# Altium project USB-C Power Delivery Board.PrjPcb
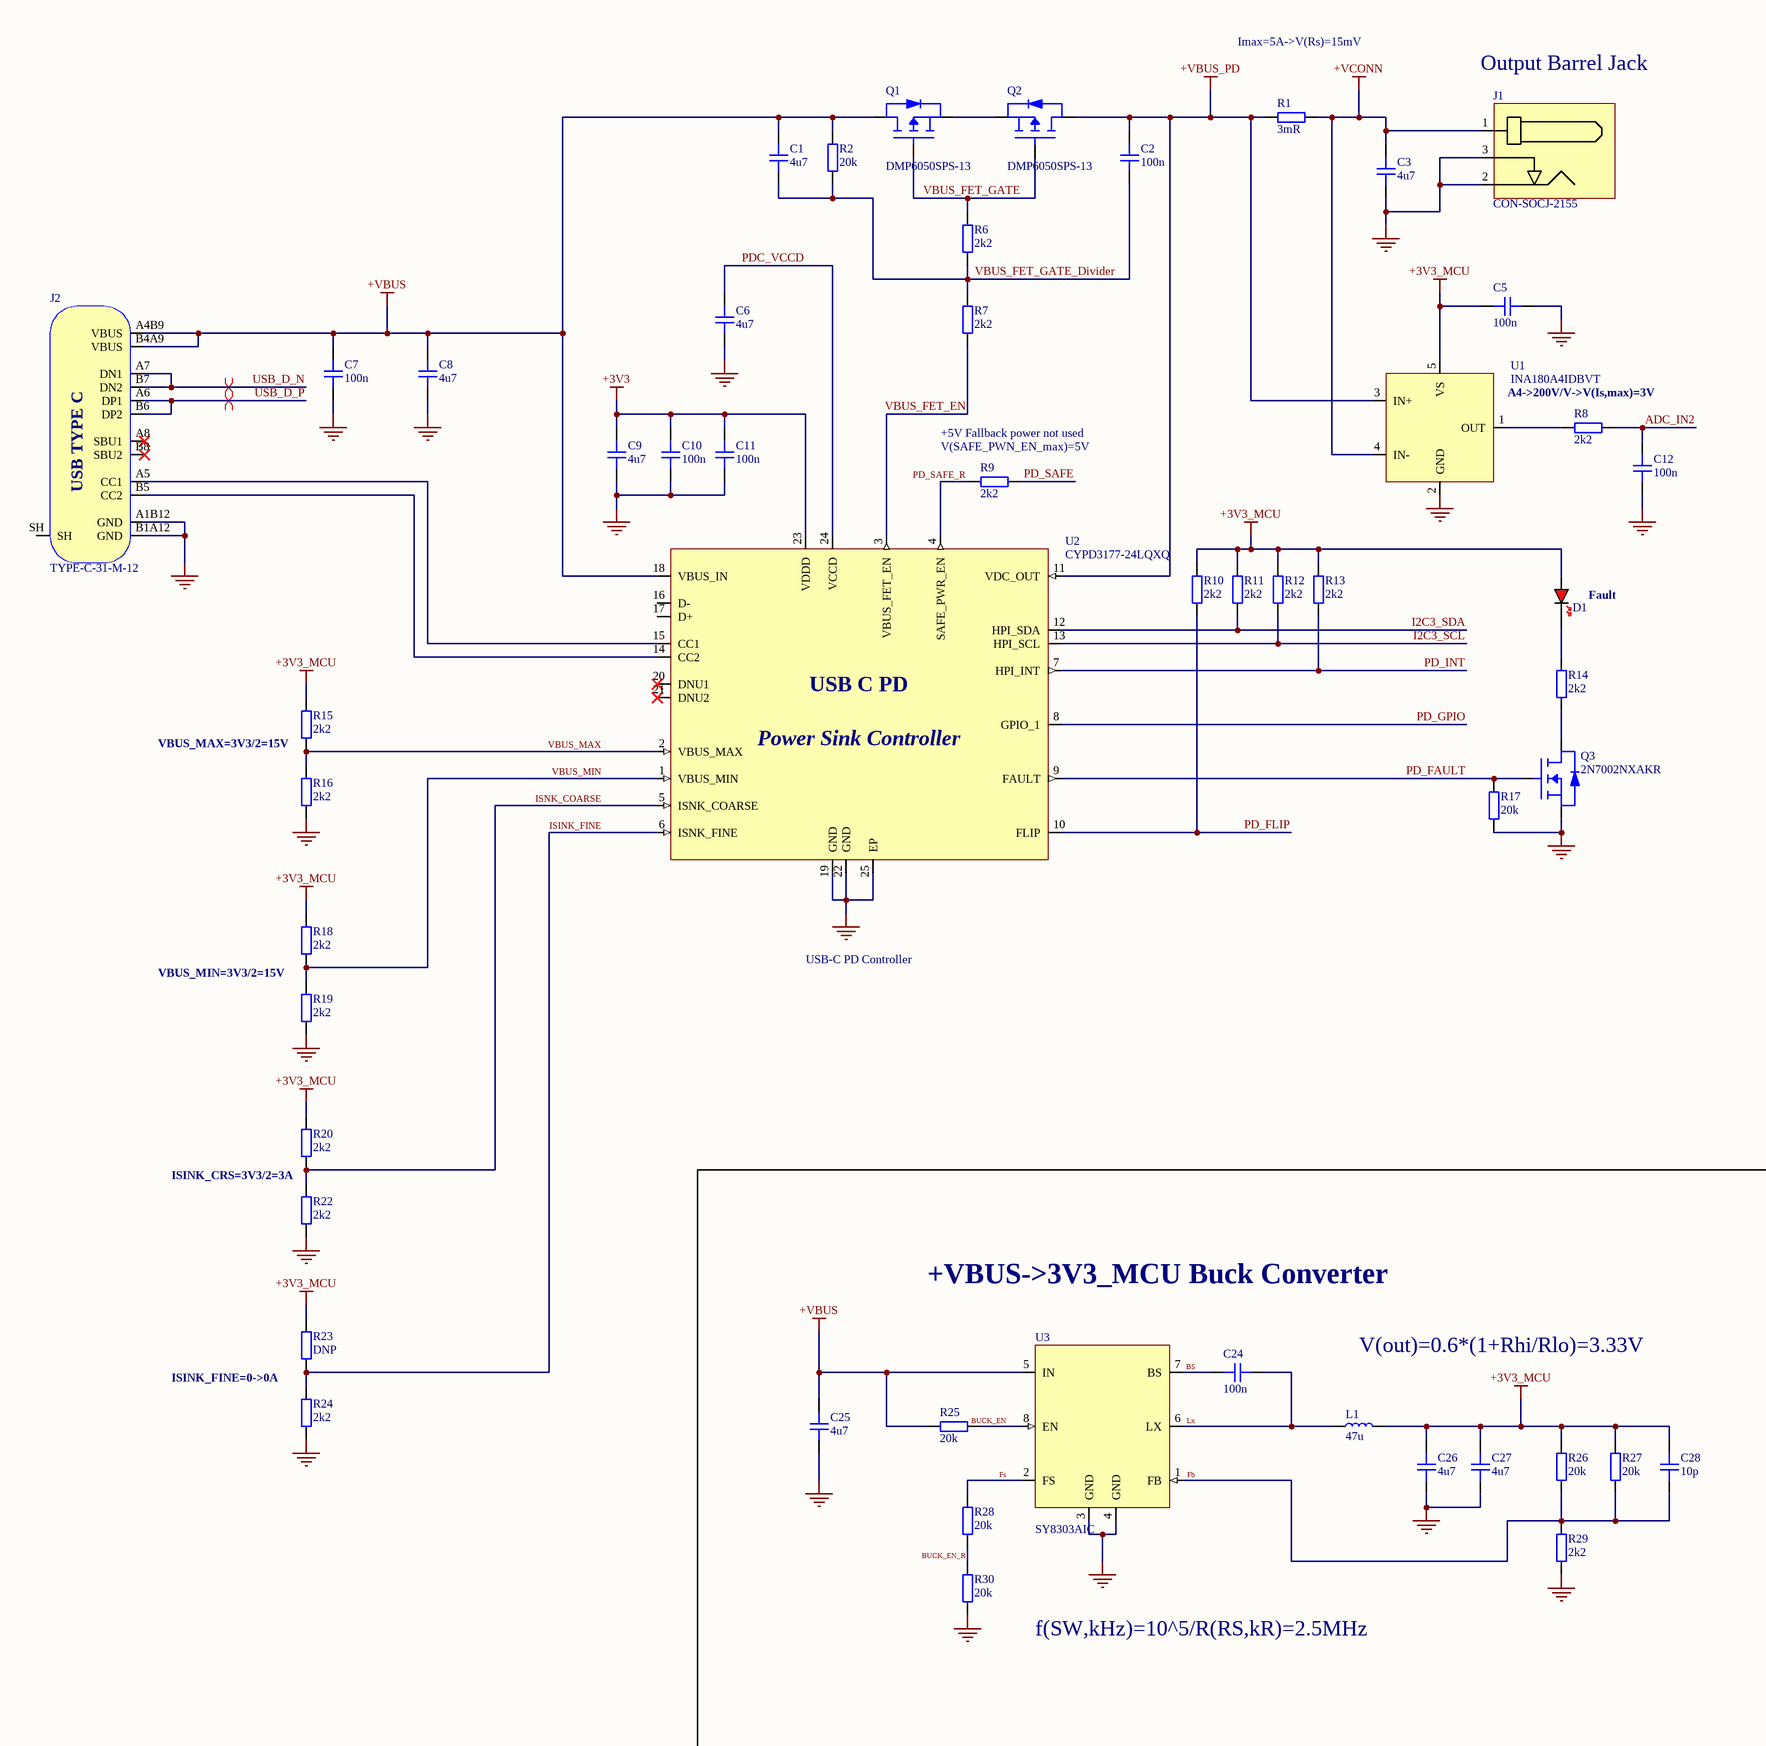
[diagram p0: USB-C Power Delivery Board.SchDoc, left]
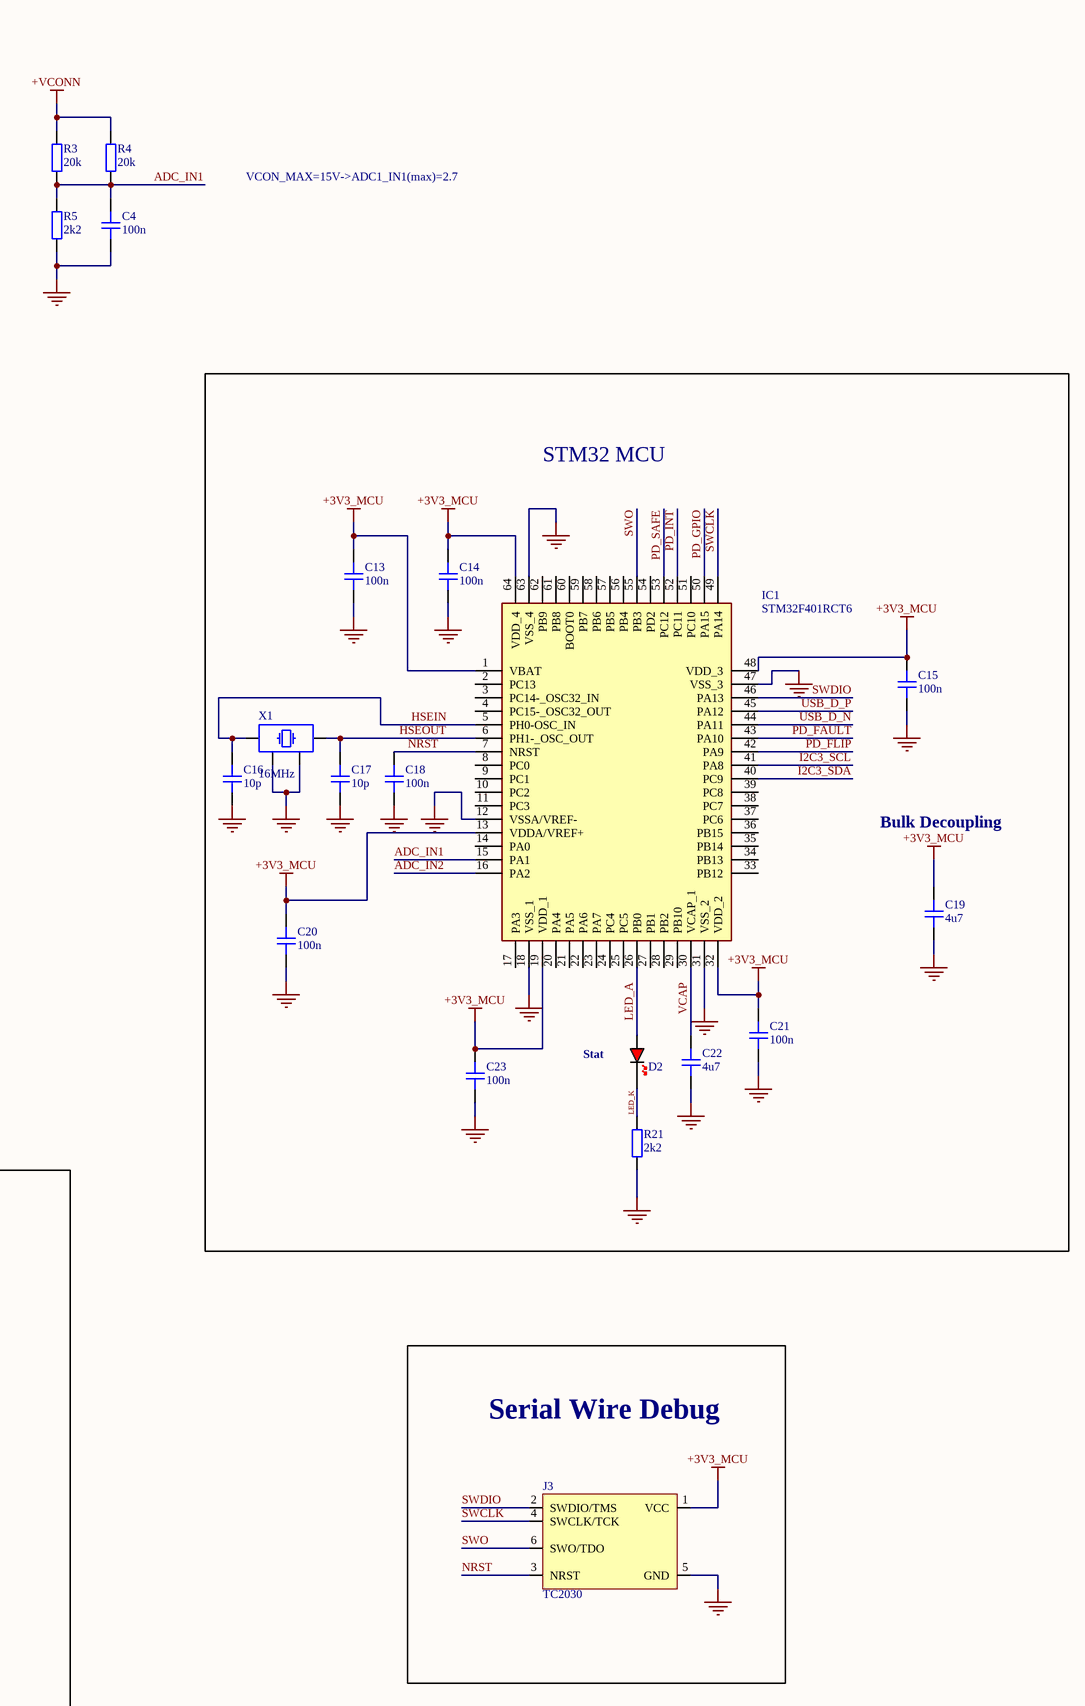
[diagram p1: USB-C Power Delivery Board.SchDoc, right]
1 sheet, 72 parts. Net scope: global (net labels, ports and power ports of the same name join across sheets).
Board file: USB-C Power Delivery Board.PcbDoc

## Sheet USB-C Power Delivery Board.SchDoc
size A2; SheetNumber: 1; SheetTotal: 1

### Parts
C1  4u7  [CAP_0603]
C2  100n  [CAP_0402]
C3  4u7  [CAP_0603]
C4  100n  [CAP_0402]
C5  100n  [CAP_0402]
C6  4u7  [CAP_0603]
C7  100n  [CAP_0402]
C8  4u7  [CAP_0603]
C9  4u7  [CAP_0603]
C10  100n  [CAP_0402]
C11  100n  [CAP_0402]
C12  100n  [CAP_0402]
C13  100n  [CAP_0402]
C14  100n  [CAP_0402]
C15  100n  [CAP_0402]
C16  10p  [CAP_0402]
C17  10p  [CAP_0402]
C18  100n  [CAP_0402]
C19  4u7  [CAP_0603]
C20  100n  [CAP_0402]
C21  100n  [CAP_0402]
C22  4u7  [CAP_0603]
C23  100n  [CAP_0402]
C24  100n  [CAP_0402]
C25  4u7  [CAP_0603]
C26  4u7  [CAP_0603]
C27  4u7  [CAP_0603]
C28  10p  [CAP_0402]
D1  RED  [LED_0402_RED]  (value not drawn)
D2  RED  [LED_0402_RED]  (value not drawn)
IC1  STM32F401RCT6  [QFP50P1200X1200X160-64N]
J1  CON-SOCJ-2155  [CON-SOCJ-2155]
J2  TYPE-C-31-M-12  [TYPE-C-31-M-12]
J3  TC2030  [TC2030-FP]  (no BOM)
L1  47u  [SPM10065VT-220M-D]
Q1  DMP6050SPS-13  [PowerDI5060-8]
Q2  DMP6050SPS-13  [PowerDI5060-8]
Q3  2N7002NXAKR  [SSM3J338R,LF-SOT23-F]
R1  3mR  [RES_5931]
R2  20k  [RES_0402]
R3  20k  [RES_0402]
R4  20k  [RES_0402]
R5  2k2  [RES_0402]
R6  2k2  [RES_0402]
R7  2k2  [RES_0402]
R8  2k2  [RES_0402]
R9  2k2  [RES_0402]
R10  2k2  [RES_0402]
R11  2k2  [RES_0402]
R12  2k2  [RES_0402]
R13  2k2  [RES_0402]
R14  2k2  [RES_0402]
R15  2k2  [RES_0402]
R16  2k2  [RES_0402]
R17  20k  [RES_0402]
R18  2k2  [RES_0402]
R19  2k2  [RES_0402]
R20  2k2  [RES_0402]
R21  2k2  [RES_0402]
R22  2k2  [RES_0402]
R23  DNP  [RES_0402]
R24  2k2  [RES_0402]
R25  20k  [RES_0402]
R26  20k  [RES_0402]
R27  20k  [RES_0402]
R28  20k  [RES_0402]
R29  2k2  [RES_0402]
R30  20k  [RES_0402]
U1  INA180A4IDBVT  [SOT-23-5]
U2  CYPD3177-24LQXQ  [QFN-24-0MM5]
U3  SY8303AIC  [TSOT23-8]
X1  16MHz  [XTAL_2520]

### Blocks framed on the sheet
STM32 MCU: C13-C23 D2 IC1 R21 X1
+VBUS->3V3_MCU Buck Converter: C24-C28 L1 R25-R30 U3
Serial Wire Debug: J3

### Nets
+3V3: C9.2 C10.2 C11.2 U2.23(VDDD)
+3V3_MCU: C5.2 C13.1 C14.1 C15.1 C19.2 C20.1 C21.1 C23.1 C26.1 C27.1 C28.1 D1.A IC1.1(VBAT) IC1.13(VDDA/VREF+) IC1.19(VDD_1) IC1.32(VDD_2) IC1.48(VDD_3) IC1.64(VDD_4) J3.1(VCC) L1.2 R10.1 R11.1 R12.1 R13.1 R15.2 R18.2 R20.2 R23.2 R26.2 R27.2 U1.5(VS)
+VBUS: C1.2 C7.2 C8.2 C25.2 J2.A4B9(VBUS) J2.B4A9(VBUS) Q1.1(D) R2.2 R25.1 U2.18(VBUS_IN) U3.5(IN)
+VBUS_PD: C2.2 Q2.1(D) R1.2 U1.3(IN+) U2.11(VDC_OUT)
+VCONN: C3.2 J1.1 R1.1 R3.1 R4.1 U1.4(IN-)
GND: C3.1 C4.2 C5.1 C6.1 C7.1 C8.1 C9.1 C10.1 C11.1 C12.2 C13.2 C14.2 C15.2 C16.2 C17.2 C18.2 C19.1 C20.2 C21.2 C22.1 C23.2 C25.1 C26.2 C27.2 IC1.12(VSSA/VREF-) IC1.18(VSS_1) IC1.31(VSS_2) IC1.47(VSS_3) IC1.63(VSS_4) J1.2 J1.3 J2.A1B12(GND) J2.B1A12(GND) J3.5(GND) Q3.S R5.2 R16.1 R17.1 R19.1 R21.2 R22.1 R24.1 R29.2 R30.2 U1.2(GND) U2.19(GND) U2.22(GND) U2.25(EP) U3.3(GND) U3.4(GND) X1.2 X1.4
ADC_IN1: C4.1 IC1.15(PA1) R3.2 R4.2 R5.1
ADC_IN2: C12.1 IC1.16(PA2) R8.1
BS: C24.1 U3.7(BS)
BUCK_EN: R25.2 U3.8(EN)
BUCK_EN_R: R28.2 R30.1
Fb: C28.2 R26.1 R27.1 R29.1 U3.1(FB)
Fs: R28.1 U3.2(FS)
HSEIN: C16.1 IC1.5(PH0-OSC_IN) X1.1
HSEOUT: C17.1 IC1.6(PH1-_OSC_OUT) X1.3
I2C3_SCL: IC1.41(PA8) R12.2 U2.13(HPI_SCL)
I2C3_SDA: IC1.40(PC9) R11.2 U2.12(HPI_SDA)
ISINK_FINE: R23.1 R24.2 U2.6(ISNK_FINE)
ISNK_COARSE: R20.1 R22.2 U2.5(ISNK_COARSE)
LED_A: D2.A IC1.26(PB0)
LED_K: D2.K R21.1
Lx: C24.2 L1.1 U3.6(LX)
NRST: C18.1 IC1.7(NRST) J3.3(NRST)
PD_FAULT: IC1.43(PA10) Q3.G R17.2 U2.9(FAULT)
PD_FLIP: IC1.42(PA9) R10.2 U2.10(FLIP)
PD_GPIO: IC1.50(PA15) U2.8(GPIO_1)
PD_INT: IC1.52(PC11) R13.2 U2.7(HPI_INT)
PD_SAFE: IC1.53(PC12) R9.1
PD_SAFE_R: R9.2 U2.4(SAFE_PWR_EN)
PDC_VCCD: C6.2 U2.24(VCCD)
SWCLK: IC1.49(PA14) J3.4(SWCLK/TCK)
SWDIO: IC1.46(PA13) J3.2(SWDIO/TMS)
SWO: IC1.55(PB3) J3.6(SWO/TDO)
USB_D_N: IC1.44(PA11) J2.A7(DN1) J2.B7(DN2)
USB_D_P: IC1.45(PA12) J2.A6(DP1) J2.B6(DP2)
VBUS_FET_EN: R7.1 U2.3(VBUS_FET_EN)
VBUS_FET_GATE: Q1.2(G) Q2.2(G) R6.2
VBUS_FET_GATE_Divider: C1.1 C2.1 R2.1 R6.1 R7.2
VBUS_MAX: R15.1 R16.2 U2.2(VBUS_MAX)
VBUS_MIN: R18.1 R19.2 U2.1(VBUS_MIN)
VCAP: C22.2 IC1.30(VCAP_1)
NetD1_K: D1.K R14.1
NetJ2_A5: J2.A5(CC1) U2.15(CC1)
NetJ2_B5: J2.B5(CC2) U2.14(CC2)
NetQ1_3: Q1.3(S) Q2.3(S)
NetQ3_D: Q3.D R14.2
NetR8_2: R8.2 U1.1(OUT)

Not connected (* = marked no-connect by the designer): IC1 2(PC13) 3(PC14-_OSC32_IN) 4(PC15-_OSC32_OUT) 8(PC0) 9(PC1) 10(PC2) 11(PC3) 14(PA0) 17(PA3) 20(PA4) 21(PA5) 22(PA6) 23(PA7) 24(PC4) 25(PC5) 27(PB1) 28(PB2) 29(PB10) 33(PB12) 34(PB13) 35(PB14) 36(PB15) 37(PC6) 38(PC7) 39(PC8) 51(PC10) 54(PD2) 56(PB4) 57(PB5) 58(PB6) 59(PB7) 60(BOOT0) 61(PB8) 62(PB9); J2 A8(SBU1)* B8(SBU2)* SH; U2 16(D-) 17(D+) 20(DNU1)* 21(DNU2)*

### Layout directives
differential pair: USB_D_N, USB_D_P

### Notes on the sheet
- Imax=5A->V(Rs)=15mV
- Output Barrel Jack
- VCON_MAX=15V->ADC1_IN1(max)=2.7
- (near U1) A4->200V/V->V(Is,max)=3V
- (near R9) V(SAFE_PWN_EN_max)=5V
- (near R9) +5V Fallback power not used
- (near D1) Fault
- VBUS_MAX=3V3/2=15V
- Bulk Decoupling
- VBUS_MIN=3V3/2=15V
- USB-C PD Controller
- (near D2) Stat
- ISINK_CRS=3V3/2=3A
- V(out)=0.6*(1+Rhi/Rlo)=3.33V
- ISINK_FINE=0->0A
- f(SW,kHz)=10^5/R(RS,kR)=2.5MHz
- (in symbol CYPD3177-24LQXQ) USB C PD; Power Sink Controller
- (in symbol TYPE-C-31-M-12) USB TYPE C

### Library data of the parts
C1 C3 C6 C8 C9 C19 C22 C25-C27 = CAP_0603_50V: Capacitor SMD 0603 50V
C2 C4 C5 C7 C10-C18 C20 C21 C23 C24 C28 = CAP_0402_50V: Capacitor SMD 0402 50V
D1 D2 = LED_0402_RED: LED 0402 RED SMD
IC1 = STM32F401RCT6: Integrated Circuit; Manufacturer_Name: STMicroelectronics; Datasheet Link: http://www.st.com/web/en/resource/technical/document/datasheet/DM00086815.pdf; Height: 1.6mm; Manufacturer_Part_Number: STM32F401RCT6; Mouser Part Number: 511-STM32F401RCT6; Mouser Price/Stock: https://www.mouser.co.uk/ProductDetail/STMicroelectronics/STM32F401RCT6?qs=DqCdCwOw4%2F4JITyspz8omA%3D%3D; Arrow Part Number: STM32F401RCT6; Arrow Price/Stock: https://www.arrow.com/en/products/stm32f401rct6/stmicroelectronics?region=nac
J1 = CON-SOCJ-2155: DC Barrell Jack 2.1mm 30V 2.5A THT; Manufacturer: Gravitech; Manufacturer Part Number: CON-SOCJ-2155
J2 = TYPE-C-31-M-12: USB Type C Connector Horizontal SMT; Manufacturer: Koren Hroparts; Manufacturer Part Number: TYPE-C-31-M-12
J3 = TC2030: Tag-Connect No-Solder SWD Debug Connector DO NOT PLACE; Manufacturer: Tag-Connect; Manufacturer Part Number: TC2030
L1 = SPM10065VT-470M-D: Inductor SMD 47uH 4A 20%; Manufacturer: TDK; Manufacturer Part Number: SPM10065VT-470M-D
Q1 Q2 = DMP6050SPS-13: MOSFET P-Channel Vds=60V Vgs=+-20V Id=26A Rds(on|=50mOhms; Manufacturer: Diodes Incorporated; Manufacturer Part Number: DMP6050SPS-13
Q3 = 2N7002NXAKR: MOSFET N-Channel Vds=60V Id=300mA with ESD Protection; Manufacturer: Nexperia; Manufacturer Part Number: 2N7002NXAKR
R1 = RES_5931: Current Sense Resistor SMD 0805; Manufacturer: *; Manufacturer Part Number: *; Distributor Link: *
R2-R30 = RES_0402: Resistor SMD 0402; Manufacturer: *; Manufacturer Part Number: *; Distributor Link: *
U1 = INA180A4IDBVT: Current Sense Amplifier 200V/V Gain 105kHz BW SOT-23-5; Manufacturer: Texas Instruments; Manufacturer Part Number: INA180A4IDBVT
U2 = CYPD3177-24LQXQ: USB Type-C Port Controller for Power Sinks; Manufacturer: Cypress Semicon; Manufacturer Part Number: CYPD3177-24LQXQ; Distributor Link: https://www.lcsc.com/product-detail/USB-ICs_Cypress-Semicon-CYPD3177-24LQXQ_C2959321.html
U3 = SY8303AIC: High Efficiency Fast Response, 3A, 40V Input Synchronous Step Down Regulator; Manufacturer: Silergy; Manufacturer Part Number: SY8303AIC; Distributor Link: https://www.lcsc.com/product-detail/DC-DC-Converters_Silergy-Corp-SY8303AIC_C97054.html; LCSC: C97054
X1 = XTAL_2520: Crystal SMD 2520; Distributor Link: *